# Altium schematic sheet RING.SchDoc
size Letter; DrawnBy: Titan Yuan; SheetNumber: 1; SheetTotal: 1
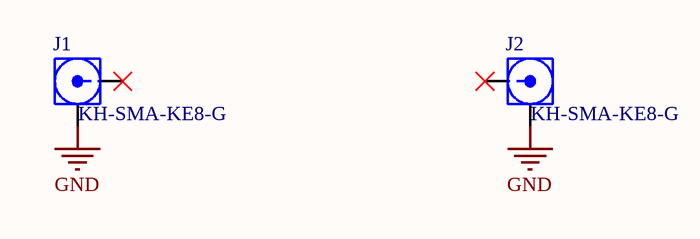
[diagram p0: RING.SchDoc]

## Parts
J1  KH-SMA-KE8-G  [KH-SMA-KE8-G]
J2  KH-SMA-KE8-G  [KH-SMA-KE8-G]

## Nets
GND: J1.2 J2.2

Not connected (* = marked no-connect by the designer): J1 1*; J2 1*

## Library data of the parts
J1 J2 = CONN_RF_SMA: Connector RF SMA Generic; Manufacturer: Shenzhen Kinghelm Electron Co; Manufacturer Part Number: KH-SMA-KE8-G; LCSC: C530661